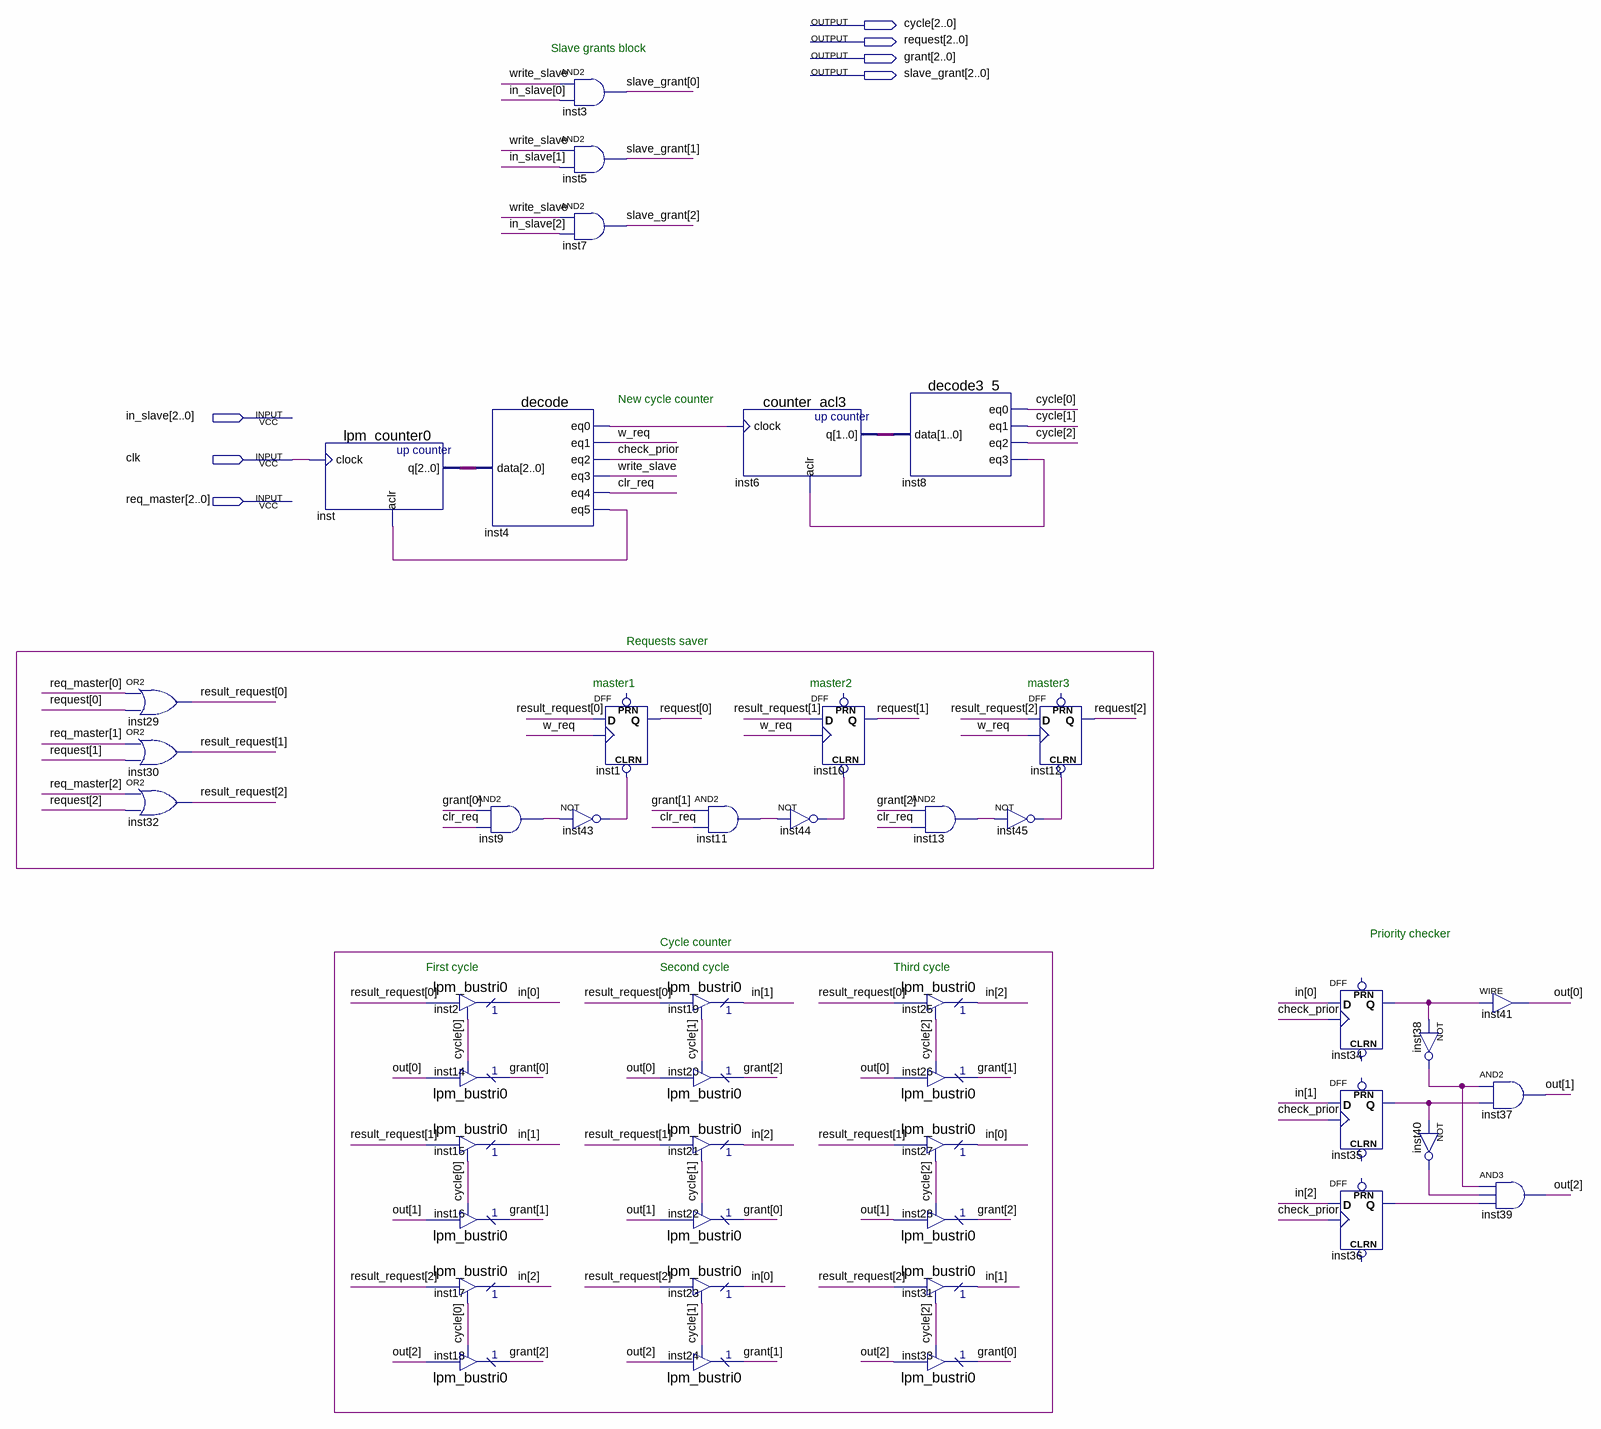
[diagram p0: schematic sheet]
// Quartus schematic arbitrator.bdf as structural Verilog: 45 symbols, 7 pins
module arbitrator (
  input  [2:0] in_slave,
  input  clk,
  input  [2:0] req_master,
  output [2:0] cycle,
  output [2:0] request,
  output [2:0] grant,
  output [2:0] slave_grant
);

  wire check_prior, clr_req, inst4_eq0, inst4_eq5, inst8_eq3, inst9_out, inst11_out, inst13_out, inst34_q,
       inst35_q, inst36_q, inst38_out, inst40_out, inst43_out, inst44_out, inst45_out, w_req, write_slave;
  wire [1:0] inst6_q;
  wire [2:0] in, inst_q, out, result_request;

  or inst29 (result_request[0], req_master[0], request[0]);
  or inst30 (result_request[1], req_master[1], request[1]);
  or inst32 (result_request[2], req_master[2], request[2]);
  lpm_counter0 inst (.clock(clk), .aclr(inst4_eq5), .q(inst_q));
  decode inst4 (
    .data(inst_q), .eq0(inst4_eq0), .eq1(w_req), .eq2(check_prior), .eq3(write_slave), .eq4(clr_req),
    .eq5(inst4_eq5));
  and inst9 (inst9_out, grant[0], clr_req);
  lpm_bustri0 inst2 (.enabledt(cycle[0]), .data(result_request[0]), .tridata(in[0]));
  lpm_bustri0 inst14 (.enabledt(cycle[0]), .data(out[0]), .tridata(grant[0]));
  lpm_bustri0 inst15 (.enabledt(cycle[0]), .data(result_request[1]), .tridata(in[1]));
  lpm_bustri0 inst16 (.enabledt(cycle[0]), .data(out[1]), .tridata(grant[1]));
  lpm_bustri0 inst17 (.enabledt(cycle[0]), .data(result_request[2]), .tridata(in[2]));
  lpm_bustri0 inst18 (.enabledt(cycle[0]), .data(out[2]), .tridata(grant[2]));
  and inst3 (slave_grant[0], write_slave, in_slave[0]);
  and inst5 (slave_grant[1], write_slave, in_slave[1]);
  and inst7 (slave_grant[2], write_slave, in_slave[2]);
  DFF inst1 (.CLRN(inst43_out), .CLK(w_req), .D(result_request[0]), .Q(request[0]));  // open: PRN
  not inst43 (inst43_out, inst9_out);
  lpm_bustri0 inst19 (.enabledt(cycle[1]), .data(result_request[0]), .tridata(in[1]));
  lpm_bustri0 inst20 (.enabledt(cycle[1]), .data(out[0]), .tridata(grant[2]));
  lpm_bustri0 inst21 (.enabledt(cycle[1]), .data(result_request[1]), .tridata(in[2]));
  lpm_bustri0 inst22 (.enabledt(cycle[1]), .data(out[1]), .tridata(grant[0]));
  lpm_bustri0 inst23 (.enabledt(cycle[1]), .data(result_request[2]), .tridata(in[0]));
  lpm_bustri0 inst24 (.enabledt(cycle[1]), .data(out[2]), .tridata(grant[1]));
  counter_acl3 inst6 (.clock(inst4_eq0), .aclr(inst8_eq3), .q(inst6_q));
  and inst11 (inst11_out, grant[1], clr_req);
  DFF inst10 (.CLRN(inst44_out), .CLK(w_req), .D(result_request[1]), .Q(request[1]));  // open: PRN
  not inst44 (inst44_out, inst11_out);
  decode3_5 inst8 (.data(inst6_q), .eq0(cycle[0]), .eq1(cycle[1]), .eq2(cycle[2]), .eq3(inst8_eq3));
  and inst13 (inst13_out, grant[2], clr_req);
  lpm_bustri0 inst25 (.enabledt(cycle[2]), .data(result_request[0]), .tridata(in[2]));
  lpm_bustri0 inst26 (.enabledt(cycle[2]), .data(out[0]), .tridata(grant[1]));
  lpm_bustri0 inst27 (.enabledt(cycle[2]), .data(result_request[1]), .tridata(in[0]));
  lpm_bustri0 inst28 (.enabledt(cycle[2]), .data(out[1]), .tridata(grant[2]));
  lpm_bustri0 inst31 (.enabledt(cycle[2]), .data(result_request[2]), .tridata(in[1]));
  lpm_bustri0 inst33 (.enabledt(cycle[2]), .data(out[2]), .tridata(grant[0]));
  not inst45 (inst45_out, inst13_out);
  DFF inst12 (.CLRN(inst45_out), .CLK(w_req), .D(result_request[2]), .Q(request[2]));  // open: PRN
  DFF inst34 (.CLK(check_prior), .D(in[0]), .Q(inst34_q));  // open: CLRN, PRN
  DFF inst35 (.CLK(check_prior), .D(in[1]), .Q(inst35_q));  // open: CLRN, PRN
  DFF inst36 (.CLK(check_prior), .D(in[2]), .Q(inst36_q));  // open: CLRN, PRN
  not inst38 (inst38_out, inst34_q);
  not inst40 (inst40_out, inst35_q);
  assign out[0] = inst34_q;  // WIRE inst41
  and inst37 (out[1], inst38_out, inst35_q);
  and inst39 (out[2], inst38_out, inst40_out, inst36_q);

  // Notes on the sheet:
  //   Slave grants block
  //   New cycle counter
  //   Requests saver
  //   master1
  //   master2
  //   master3
  //   Priority checker
  //   Cycle counter
  //   First cycle
  //   Second cycle
  //   Third cycle
endmodule
